# EAGLE schematic Top module (EAGLE 7.5.0)
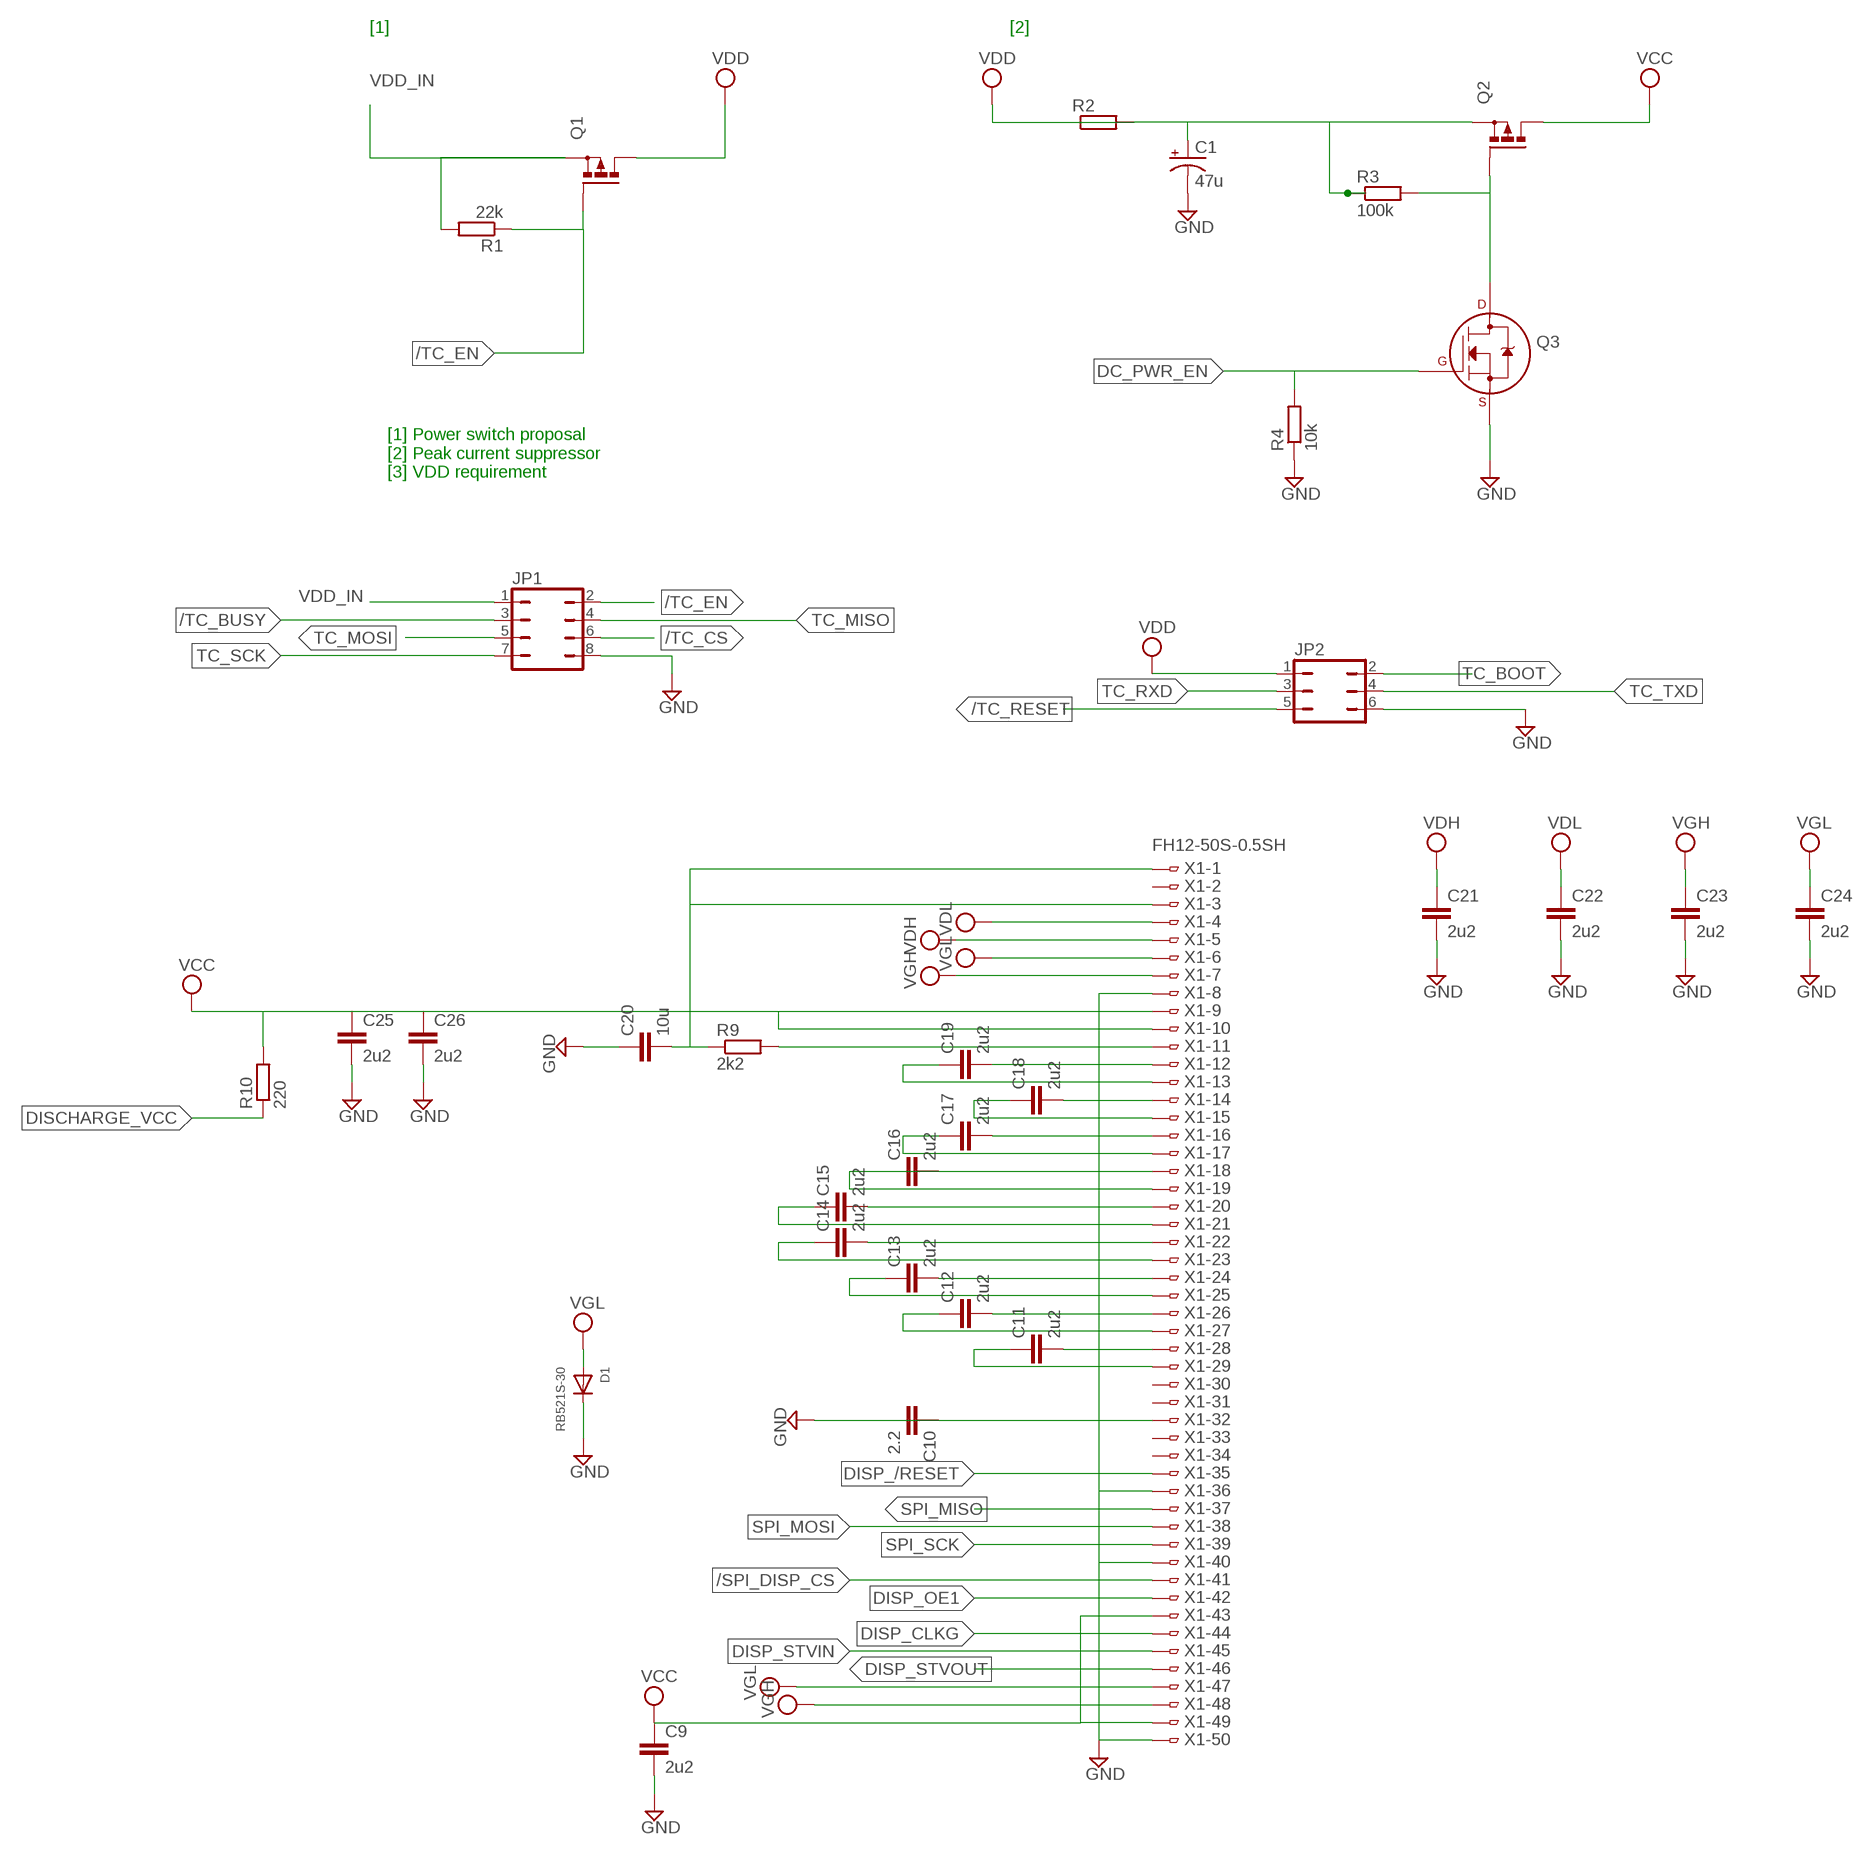
[diagram p0: schematic, sheet 1, part 1 of 2]
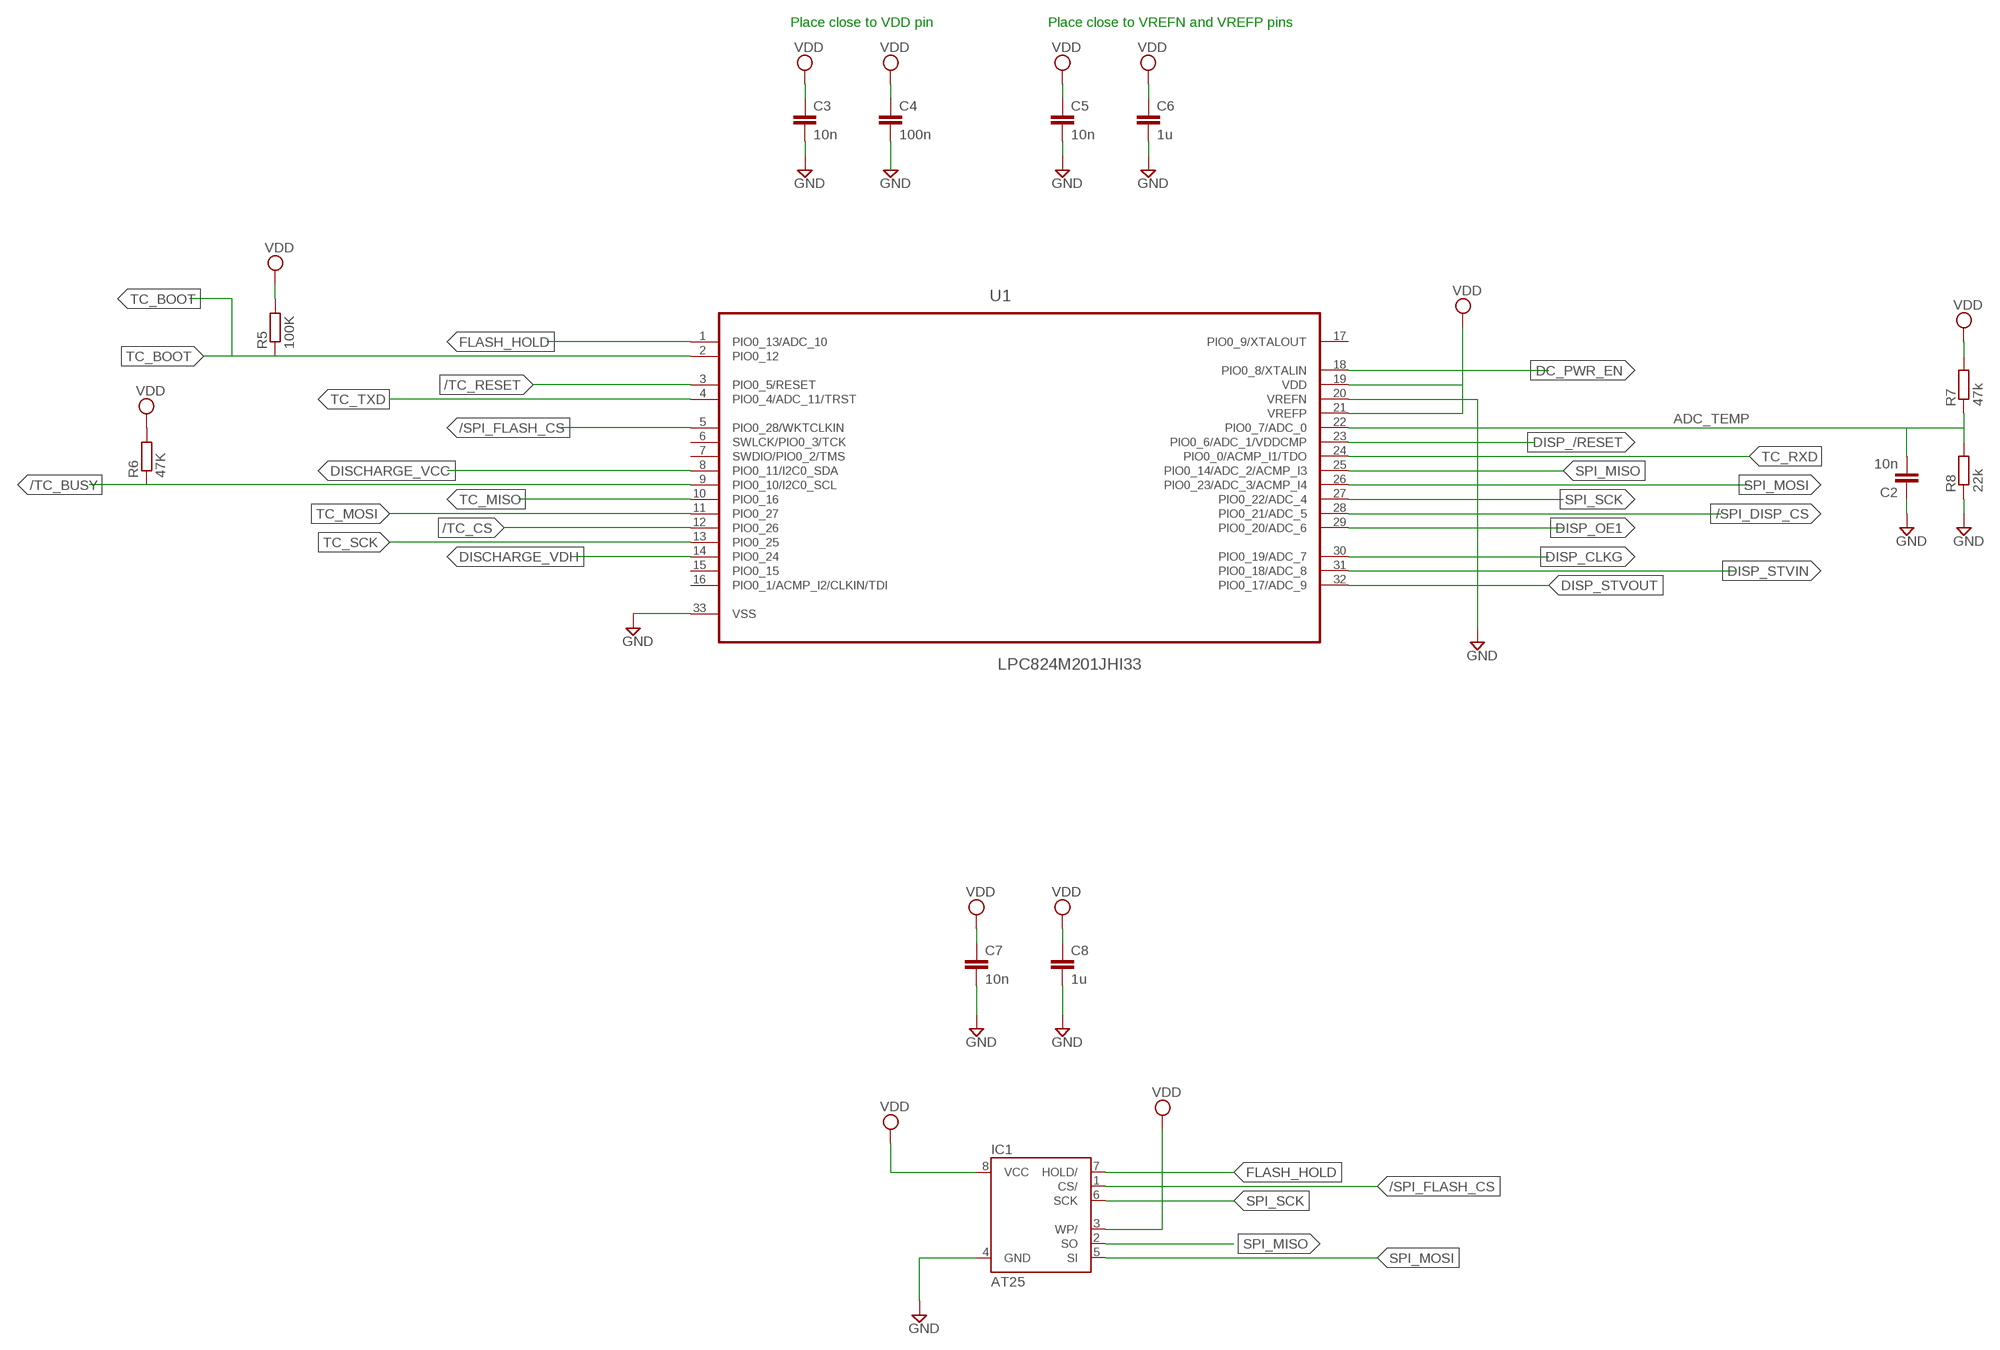
[diagram p1: schematic, sheet 1, part 2 of 2]

## Parts
C1  47u  CPOL-USB/3528-21R  [B/3528-21R]
C2  10n  C-EUC0603  [C0603]
C3  10n  C-EUC0603  [C0603]
C4  100n  C-EUC0603  [C0603]
C5  10n  C-EUC0603  [C0603]
C6  1u  C-EUC0603  [C0603]
C7  10n  C-EUC0603  [C0603]
C8  1u  C-EUC0603  [C0603]
C9  2u2  C-EUC0603  [C0603]
C10  2.2  C-EUC0603  [C0603]
C11  2u2  C-EUC1608  [C1608]
C12  2u2  C-EUC1608  [C1608]
C13  2u2  C-EUC1608  [C1608]
C14  2u2  C-EUC1608  [C1608]
C15  2u2  C-EUC1608  [C1608]
C16  2u2  C-EUC1608  [C1608]
C17  2u2  C-EUC1608  [C1608]
C18  2u2  C-EUC1608  [C1608]
C19  2u2  C-EUC1608  [C1608]
C20  10u  C-EUC1608  [C1608]
C21  2u2  C-EUC1608  [C1608]
C22  2u2  C-EUC1608  [C1608]
C23  2u2  C-EUC1608  [C1608]
C24  2u2  C-EUC1608  [C1608]
C25  2u2  C-EUC1608  [C1608]
C26  2u2  C-EUC1608  [C1608]
D1  RB521S-30  DIODESOD-523  [SOD-523]
IC1  AT25  [SOIC8]
JP1  JP4Q  [JP4Q]
JP2  JP3Q  [JP3Q]
Q1  NTR4171PTG  [SOT23]
Q2  NTR4171PTG  [SOT23]
Q3  2N7002_SOT23  [SOT-23]
R1  22k  R-EU_R0603  [R0603]
R2  R-EU_R0603  [R0603]
R3  100k  R-EU_R0603  [R0603]
R4  10k  R-EU_R0603  [R0603]
R5  100K  R-EU_R0603  [R0603]
R6  47K  R-EU_R0603  [R0603]
R7  47k  R-EU_R0603  [R0603]
R8  22k  R-EU_R0603  [R0603]
R9  2k2  R-EU_R0603  [R0603]
R10  220  R-EU_R0603  [R0603]
U1  LPC824M201JHI33  [QFN65P700X700X100-33N]
X1  FH12-50S-0.5SH  [FH12-50S-0.5SH]

## Nets
/SPI_DISP_CS: U1.28(PIO0_21/ADC_5) X1.41
/SPI_FLASH_CS: IC1.1(CS/) U1.5(PIO0_28/WKTCLKIN)
/TC_BUSY: JP1.3 R6.1 U1.9(PIO0_10/I2C0_SCL)
/TC_CS: JP1.6 U1.12(PIO0_26)
/TC_EN: JP1.2 Q1.G R1.1
/TC_RESET: JP2.5 U1.3(PIO0_5/RESET)
ADC_TEMP: C2.2 R7.1 R8.2 U1.22(PIO0_7/ADC_0)
DC_PWR_EN: Q3.1(G) R4.2 U1.18(PIO0_8/XTALIN)
DISCHARGE_VCC: R10.1 U1.8(PIO0_11/I2C0_SDA)
DISCHARGE_VDH: U1.14(PIO0_24)
DISP_/RESET: U1.23(PIO0_6/ADC_1/VDDCMP) X1.35
DISP_CLKG: U1.30(PIO0_19/ADC_7) X1.44
DISP_OE1: U1.29(PIO0_20/ADC_6) X1.42
DISP_STVIN: U1.31(PIO0_18/ADC_8) X1.45
DISP_STVOUT: U1.32(PIO0_17/ADC_9) X1.46
FLASH_HOLD: IC1.7(HOLD/) U1.1(PIO0_13/ADC_10)
GND: C1.- C2.1 C3.2 C5.2 C6.2 C7.2 C8.2 C9.2 C10.1 C10.2 C20.1 C21.2 C22.2 C23.2 C24.2 C25.2 C26.2 D1.K(C) IC1.4(GND) JP1.8 JP2.6 Q3.2(S) R4.1 R8.1 U1.20(VREFN) U1.33(VSS) X1.8 X1.32 X1.36 X1.40 X1.50
N$1: C4.2
N$2: Q2.G Q3.3(D) R3.2
N$3: C11.1 X1.29
N$4: C11.2 X1.28
N$5: C12.1 X1.27
N$6: C12.2 X1.26
N$7: C13.1 X1.25
N$8: C13.2 X1.24
N$9: C14.1 X1.23
N$10: C14.2 X1.22
N$11: C15.1 X1.21
N$12: C15.2 X1.20
N$13: C16.1 C16.2 X1.18 X1.19
N$14: C17.1 X1.17
N$15: C17.2 X1.16
N$16: C18.1 X1.15
N$17: C18.2 X1.14
N$18: C19.1 X1.13
N$19: C19.2 X1.12
N$20: C20.2 R9.1 X1.1 X1.3
N$21: R9.2 X1.11
SPI_MISO: IC1.2(SO) U1.25(PIO0_14/ADC_2/ACMP_I3) X1.37
SPI_MOSI: IC1.5(SI) U1.26(PIO0_23/ADC_3/ACMP_I4) X1.38
SPI_SCK: IC1.6(SCK) U1.27(PIO0_22/ADC_4) X1.39
TC_BOOT: JP2.2 R5.1 U1.2(PIO0_12)
TC_MISO: JP1.4 U1.10(PIO0_16)
TC_MOSI: JP1.5 U1.11(PIO0_27)
TC_RXD: JP2.3 U1.24(PIO0_0/ACMP_I1/TDO)
TC_SCK: JP1.7 U1.13(PIO0_25)
TC_TXD: JP2.4 U1.4(PIO0_4/ADC_11/TRST)
VCC: C9.1 C25.1 C26.1 Q2.D R10.2 X1.9 X1.10 X1.43 X1.49
VDD: C1.+ C3.1 C4.1 C5.1 C6.1 C7.1 C8.1 IC1.3(WP/) IC1.8(VCC) JP2.1 Q1.D Q2.S R2.1 R2.2 R3.1 R5.2 R6.2 R7.2 U1.19(VDD) U1.21(VREFP)
VDD_IN: JP1.1 Q1.S R1.2
VDH: C21.1 X1.5
VDL: C22.1 X1.4
VGH: C23.1 X1.7 X1.48
VGL: C24.1 D1.A X1.6 X1.47
Unconnected: U1.6(SWLCK/PIO0_3/TCK) U1.7(SWDIO/PIO0_2/TMS) U1.15(PIO0_15) U1.16(PIO0_1/ACMP_I2/CLKIN/TDI) U1.17(PIO0_9/XTALOUT) X1.2 X1.30 X1.31 X1.33 X1.34

## Notes on the sheet
- [1] | [2]
- Place close to VDD pin | Place close to VREFN and VREFP pins
- [1] Power switch proposal
  [2] Peak current suppressor
  [3] VDD requirement

## Library data of the parts
C1 = adafruit:CPOL-US: POLARIZED CAPACITOR, American symbol
C2 = resistor:C-EU: CAPACITOR, European symbol
C3-C26 = rcl:C-EU: CAPACITOR, European symbol
D1 = adafruit:DIODE: Diode SMADIODE - SMA Surface Mount Package 20V 1A Schottky Diode Digikey: 641-1014-6-ND DO-1N4148 - Through Hole Small Current Diode SOD-123 20V 1 A (.5mV Vf) Schottky Diode - Digikey: MBRX120TPMSCT-ND SOD-323 10V 570mA (.38mV Vf, 3ns) Schottky Diode - Digikey: ZLLS410CT-ND SOD-523 30V 30mA Schottky Diode (RB751S-40TE61) - Digikey: RB751S-40TE61CT-ND SOT23-R/W - SOT23 Package (R = Solder Paste/Reflow Ovens, W = Hand-Soldering) BAT54Film 40V 300mA - Digikey: 497-7162-1-ND
IC1 = atmel:AT25*: SPI bus serial EEPROM
JP1 = jumper:JP4Q: JUMPER
JP2 = jumper:JP3Q: JUMPER
Q1 Q2 = transistor-power:NTR4171PTG: Power MOSFET P-Channel
Q3 = transistors:2N700*: 2N7000, 2N7002, NDS7002A N-channel enhancement mode MOSFET
R1 R5 R7 R8 R10 = resistor:R-EU_: RESISTOR, European symbol
R2-R4 R6 R9 = rcl:R-EU_: RESISTOR, European symbol
U1 = NXP_By_element14_Batch_1:LPC824M201JHI33: 32-bit ARM Cortex-M0 microcontroller up to 32 kB flash and 8 kB SRAM; MPN: LPC1114FHN33/201,5; OC_FARNELL: -; OC_NEWARK: 70R5584; PACKAGE: HVQFN-32; SUPPLIER: NXP
X1 = con-hirose:FH12-50S-0.5S: 0.5mm Pitch Connectors For FPC/FFC Source: Data sheet <http://www.hirose.co.jp/cataloge_hp/e58605370.pdf>; MPN: FH12-50S-0.5SH(55); OC_FARNELL: 1324557; OC_NEWARK: 34M6181